# EAGLE design MACH32 (EAGLE 9.6.0)
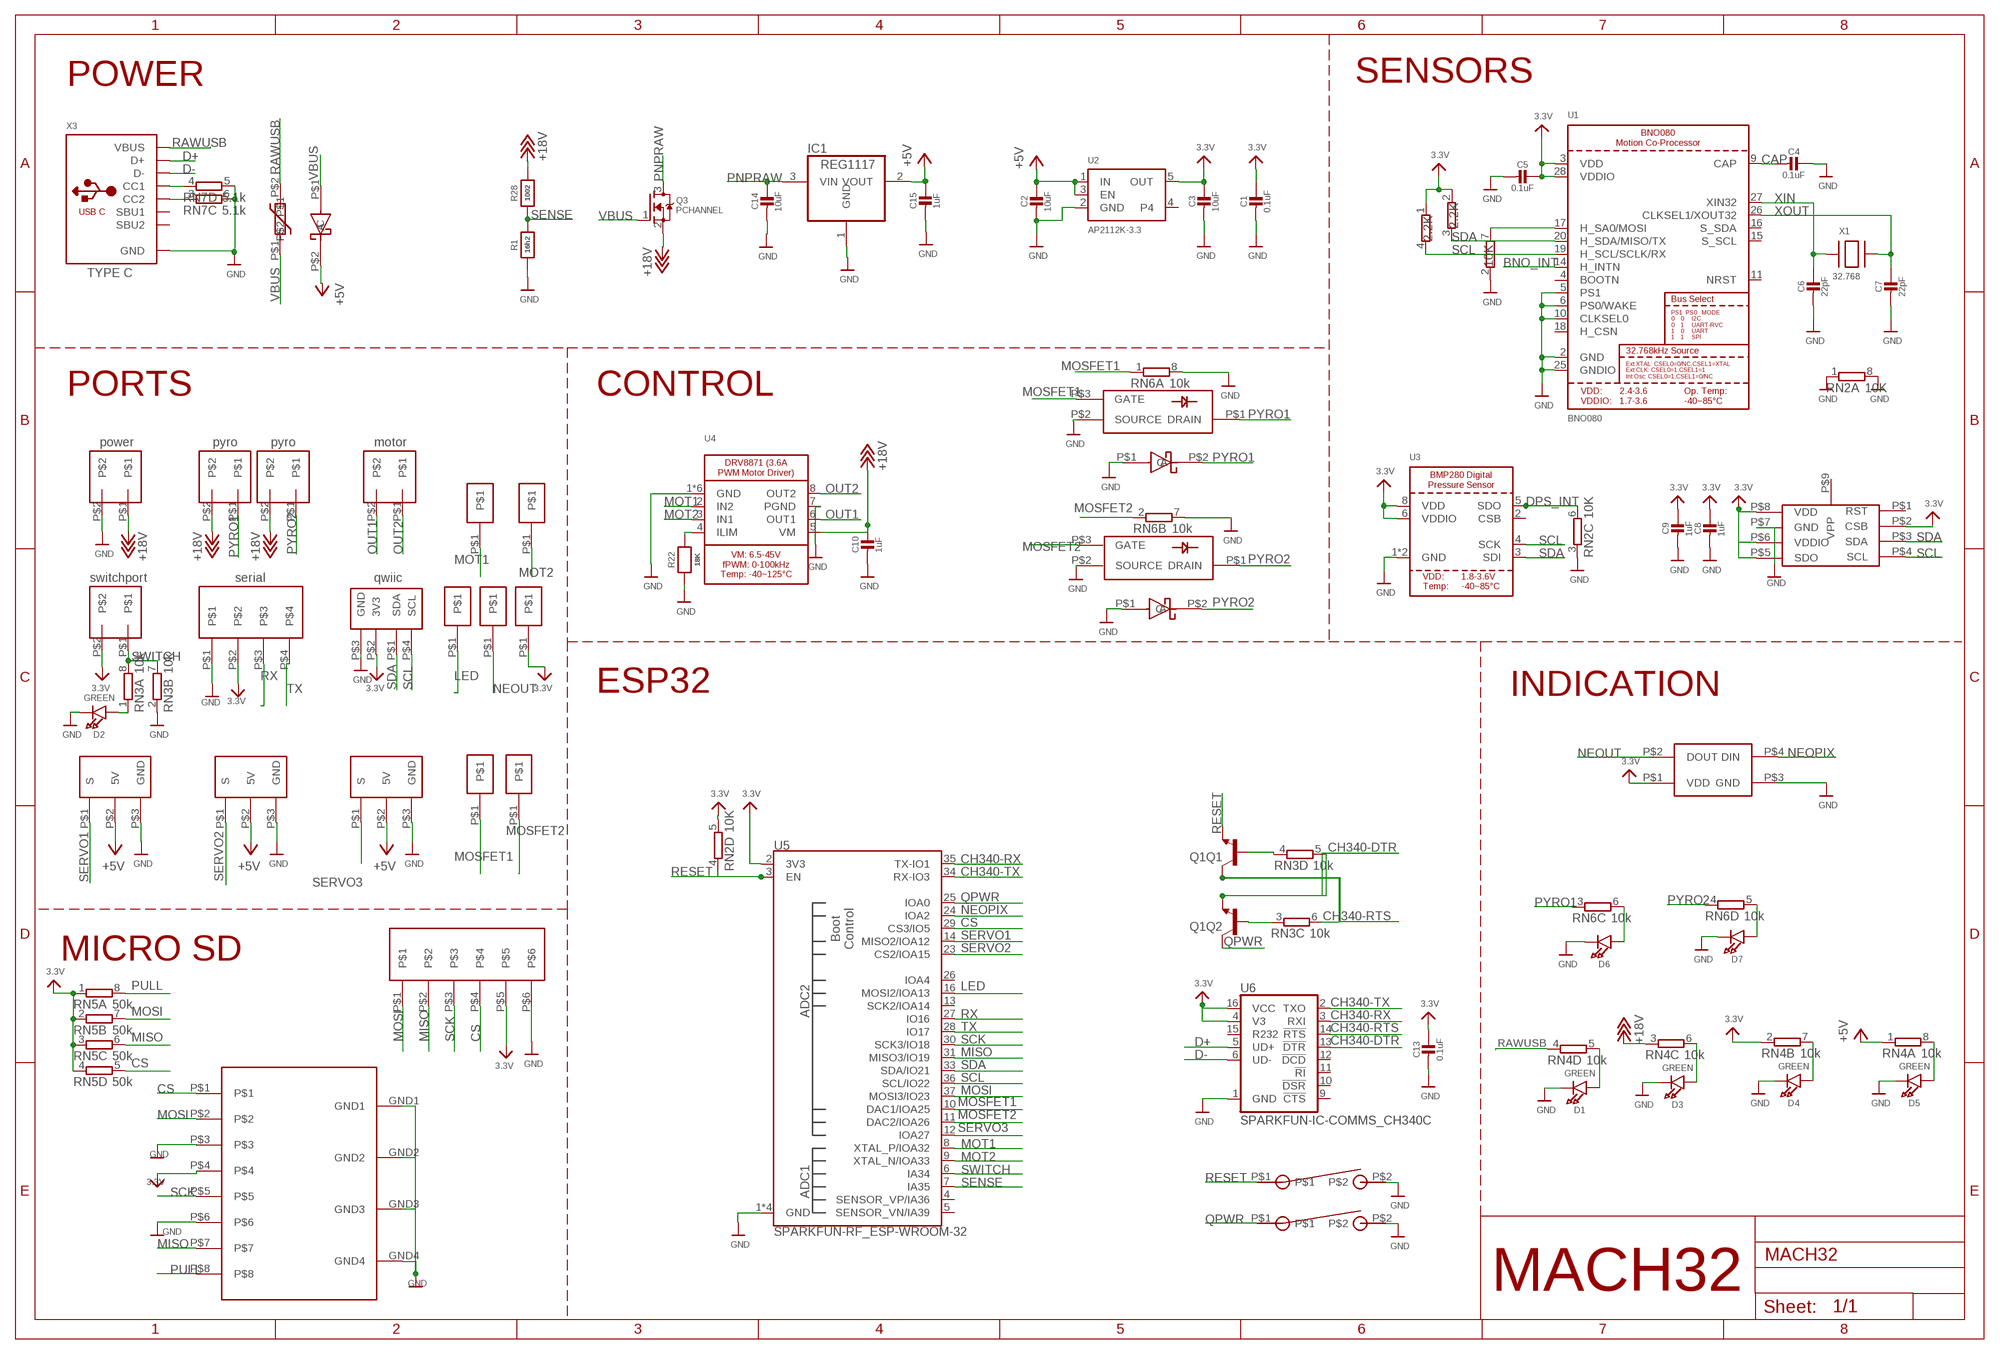
[diagram p0: schematic, sheet 1]

## Parts
C1  0.1uF  CAP_CERAMIC0603_NO  [0603-NO]
C2  10uF  CAP_CERAMIC0805-NOOUTLINE  [0805-NO]
C3  10uF  CAP_CERAMIC0805-NOOUTLINE  [0805-NO]
C4  0.1uF  CAP_CERAMIC0603_NO  [0603-NO]
C5  0.1uF  CAP_CERAMIC0603_NO  [0603-NO]
C6  22pF  CAP_CERAMIC0603_NO  [0603-NO]
C7  22pF  CAP_CERAMIC0603_NO  [0603-NO]
C8  1uF  CAP_CERAMIC0603_NO  [0603-NO]
C9  1uF  CAP_CERAMIC0603_NO  [0603-NO]
C10  1uF  CAP_CERAMIC0603_NO  [0603-NO]
C13  0.1uF  CAP_CERAMIC0603_NO  [0603-NO]
C14  10uF  CAP_CERAMIC0805-NOOUTLINE  [0805-NO]
C15  1uF  CAP_CERAMIC0603_NO  [0603-NO]
D1  GREEN  LED0603_NOOUTLINE  [CHIPLED_0603_NOOUTLINE]
D2  GREEN  LED0603_NOOUTLINE  [CHIPLED_0603_NOOUTLINE]
D3  GREEN  LED0603_NOOUTLINE  [CHIPLED_0603_NOOUTLINE]
D4  GREEN  LED0603_NOOUTLINE  [CHIPLED_0603_NOOUTLINE]
D5  GREEN  LED0603_NOOUTLINE  [CHIPLED_0603_NOOUTLINE]
D6  GREEN  LED0603_NOOUTLINE  [CHIPLED_0603_NOOUTLINE]
D7  GREEN  LED0603_NOOUTLINE  [CHIPLED_0603_NOOUTLINE]
GENERALDIODE  PG-TSDSON-8-32  [BSZ036NE2LSATMA1]
GENERALDIODE2  PG-TSDSON-8-32  [BSZ036NE2LSATMA1]
IC1  REG1117  [SOT223]
Q1  SPARKFUN-DISCRETESEMI_TRANS_NPN_DUAL-MBT3904DW1T1  [SPARKFUN-DISCRETESEMI_SC70-6]
Q3  PCHANNEL  MOSFET-NREFLOW  [SOT23]
R1  16h2  MICROBUILDER_RESISTOR_1206MP  [MICROBUILDER__1206MP]
R22  18K  MICROBUILDER_RESISTOR_0603MP  [MICROBUILDER__0603MP]
R28  1002  MICROBUILDER_RESISTOR_1206MP  [MICROBUILDER__1206MP]
RN1  2.2K  2R-NEXB34V  [EXB34V]
RN2  10K  4R-NEXB38V  [EXB38V]
RN3  10k  4R-NEXB38V  [EXB38V]
RN4  10k  4R-NEXB38V  [EXB38V]
RN5  50k  4R-NEXB38V  [EXB38V]
RN6  10k  4R-NEXB38V  [EXB38V]
RN7  5.1k  4R-NEXB38V  [EXB38V]
U1  BNO080  [BNO080]
U2  AP2112K-3.3  VREG_SOT23-5  [SOT23-5]
U3  BMP280_COMBO  [BMX280_COMBO]
U4  MICROBUILDER_DRV8871  [MICROBUILDER_HSOP8]
U5  SPARKFUN-RF_ESP-WROOM-32  [SPARKFUN-RF_ESP-WROOM-32]
U6  SPARKFUN-IC-COMMS_CH340C  [SPARKFUN-IC-COMMS_SO016]
U$17  2SMPB-02E  [2021]
U$25  OSTTEXX0104  [OSTTEXX0104]
U$27  OSTTEXX0104  [OSTTEXX0104]
U$28  OSTTEXX0104  [OSTTEXX0104]
U$30  OSTTEXX0104  [OSTTEXX0104]
U$31  DF3-4  [DF3-4]
U$32  QWIIC  [QWIIC_V]
U$34  OSTTEXX0104  [OSTTEXX0104]
U$47  PTC  [1210PTC]
U$48  SERVO  [SERVO]
U$49  SERVO  [SERVO]
U$50  SERVO  [SERVO]
U$51  SK681-2020  [SK6812-2020]
U$52  SS24FL  [XC6220]
U$53  SS24FL  [XC6220]
U$57  MALIPAD  [MALIPAD]
U$58  MALIPAD  [MALIPAD]
U$59  MALIPAD  [MALIPAD]
U$67  DF3-6  [DF3-6]
U$70  ST1W008S4AR1500  [ST1W008S4AR1500]
U$73  OMRONSWITCH  [BUTTONOMRON]
U$74  OMRONSWITCH  [BUTTONOMRON]
U$91  SS24FL  [XC6220]
U$100  MALIPAD  [MALIPAD]
U$104  MALIPAD  [MALIPAD]
U$105  MALIPAD  [MALIPAD]
U$106  MALIPAD  [MALIPAD]
X1  32.768  XTAL-3.2X1.5  [XTAL3215]
X3  MICROBUILDER_USB_C  [MICROBUILDER_USB_C_CUSB31-CFM2AX-01-X]

## Nets
3.3V [lowpower]: C1.1 C3.1 C5.1 C8.1 C9.1 C13.1 RN1.1 RN1.2 RN2.5 RN4.2 RN5.1 RN5.2 RN5.3 RN5.4 U1.3(VDD) U1.28(VDDIO) U2.5(OUT) U3.6(VDDIO) U3.8(VDD) U5.2(3V3) U6.4(V3) U6.16(VCC) U$17.P$2(CSB) U$17.P$5(SDO) U$17.P$6(VDDIO) U$17.P$8(VDD) U$31.P$2 U$32.P$2(3V3) U$34.P$2 U$51.P$1(VDD) U$57.P$1 U$67.P$5 U$70.P$4
+5V [lowpower]: C2.1 C15.1 IC1.2(VOUT) RN4.1 U2.1(IN) U2.3(EN) U$48.P$2(5V) U$49.P$2(5V) U$50.P$2(5V) U$91.P$2(C)
+18V: C10.1 Q3.2(S) R28.2 RN4.3 U4.5(VM) U$25.P$1 U$27.P$2 U$30.P$2
BNO_INT: U1.14(H_INTN)
CAP: C4.2 U1.9(CAP)
CH340-DTR: Q1.1(Q2:E) RN3.5 U6.13(!DTR)
CH340-RTS: Q1.3(Q1:C) RN3.6 U6.14(!RTS)
CH340-RX: U5.35(TX-IO1) U6.3(RXI)
CH340-TX: U5.34(RX-IO3) U6.2(TXO)
CS: RN5.5 U5.29(CS3/IO5) U$67.P$4 U$70.P$1
D+: U6.5(UD+) X3.A6(D+) X3.B6(D+)
D-: U6.6(UD-) X3.A7(D-) X3.B7(D-)
DPS_INT: RN2.6 U3.5(SDO)
GND [lowpower]: C1.2 C2.2 C3.2 C4.1 C5.2 C6.2 C7.2 C8.2 C9.2 C10.2 C13.2 C14.2 C15.2 D1.C D2.C D3.C D4.C D5.C D6.C D7.C GENERALDIODE2.P$2(SOURCE) GENERALDIODE.P$2(SOURCE) IC1.1(GND) R1.1 R22.1 RN2.1 RN2.2 RN2.3 RN2.8 RN3.2 RN6.7 RN6.8 RN7.5 RN7.6 U1.2(GND) U1.5(PS1) U1.6(PS0/WAKE) U1.10(CLKSEL0) U1.25(GNDIO) U2.2(GND) U3.1(GND) U3.7(GND) U4.1(GND) U4.7(PGND) U4.GND U4.P$1(GND) U4.P$2(GND) U4.P$3(GND) U4.P$4(GND) U5.1(GND) U5.15(GND) U5.38(GND) U5.GND U6.1(GND) U$17.P$7(GND) U$25.P$2 U$31.P$1 U$32.P$3(GND) U$48.P$3(GND) U$49.P$3(GND) U$50.P$3(GND) U$51.P$3(GND) U$52.P$1(A) U$53.P$1(A) U$67.P$6 U$70.GND1 U$70.GND2 U$70.GND3 U$70.GND4 U$70.P$3 U$70.P$6 U$73.P$2 U$74.P$2 X3.A1B12(GND) X3.B1A12(GND)
LED: U5.16(MOSI2/IOA13) U$59.P$1
MISO: RN5.6 U5.31(MISO3/IO19) U$67.P$2 U$70.P$7
MOSFET1: GENERALDIODE.P$3(GATE) RN6.1 U5.10(DAC1/IOA25) U$100.P$1
MOSFET2: GENERALDIODE2.P$3(GATE) RN6.2 U5.11(DAC2/IOA26) U$104.P$1
MOSI: RN5.7 U5.37(MOSI3/IO23) U$67.P$1 U$70.P$2
MOT1: U4.2(IN2) U5.8(XTAL_P/IOA32) U$105.P$1
MOT2: U4.3(IN1) U5.9(XTAL_N/IOA33) U$106.P$1
N$1: RN2.7 U1.17(H_SA0/MOSI)
N$3: D2.A RN3.1
N$6: D1.A RN4.5
N$9: R22.2 U4.4(ILIM)
N$10: D3.A RN4.6
N$11: D4.A RN4.7
N$12: D5.A RN4.8
N$14: Q1.5(Q1:B) RN3.4
N$15: Q1.2(Q2:B) RN3.3
N$20: RN7.4 X3.A5(CC1)
N$22: D6.A RN6.6
N$23: D7.A RN6.5
N$39: RN7.3 X3.B5(CC2)
NEOPIX: U5.24(IOA2) U$51.P$4(DIN)
NEOUT: U$51.P$2(DOUT) U$58.P$1
OUT1: U4.6(OUT1) U$28.P$2
OUT2: U4.8(OUT2) U$28.P$1
PNPRAW: C14.1 IC1.3(VIN) Q3.3(D)
PULL: RN5.8 U$70.P$8
PYRO1: GENERALDIODE.P$1(DRAIN) RN6.3 U$27.P$1 U$52.P$2(C)
PYRO2: GENERALDIODE2.P$1(DRAIN) RN6.4 U$30.P$1 U$53.P$2(C)
QPWR: Q1.6(Q2:C) U5.25(IOA0) U$73.P$1
RAWUSB: RN4.4 U$47.P$2 X3.A4B9(VBUS) X3.B4A9(VBUS)
RESET: Q1.4(Q1:E) RN2.4 U5.3(EN) U$74.P$1
RX: U5.27(IO16) U$31.P$3
SCK: U5.30(SCK3/IO18) U$67.P$3 U$70.P$5
SCL: RN1.4 U1.19(H_SCL/SCLK/RX) U3.4(SCK) U5.36(SCL/IO22) U$17.P$4(SCL) U$32.P$4(SCL)
SDA: RN1.3 U1.20(H_SDA/MISO/TX) U3.3(SDI) U5.33(SDA/IO21) U$17.P$3(SDA) U$32.P$1(SDA)
SENSE: R1.2 R28.1 U5.7(IA35)
SERVO1: U5.14(MISO2/IOA12) U$48.P$1(S)
SERVO2: U5.23(CS2/IOA15) U$49.P$1(S)
SERVO3: U5.12(IOA27) U$50.P$1(S)
SWITCH: RN3.7 RN3.8 U5.6(IA34) U$34.P$1
TX: U5.28(IO17) U$31.P$4
VBUS: Q3.1(G) U$47.P$1 U$91.P$1(A)
XIN: C6.1 U1.27(XIN32) X1.P$1
XOUT: C7.1 U1.26(CLKSEL1/XOUT32) X1.P$2
Unconnected: RN7.1 RN7.2 RN7.7 RN7.8 U1.4(BOOTN) U1.11(NRST) U1.15(S_SCL) U1.16(S_SDA) U1.18(H_CSN) U2.4 U3.2(CSB) U5.4(SENSOR_VP/IA36) U5.5(SENSOR_VN/IA39) U5.13(SCK2/IOA14) U5.26(IOA4) U6.9(!CTS) U6.10(!DSR) U6.11(!RI) U6.12(!DCD) U6.15(R232) U$17.P$1(RST) U$17.P$9(VPP) X3.A8(SBU1) X3.B8(SBU2)

## Notes on the sheet
- POWER | SENSORS
- TYPE C
- PORTS | CONTROL
- power | pyro | pyro | motor
- switchport | serial | qwiic
- ESP32 | INDICATION
- MICRO SD
- MACH32

## Library data of the parts
C1-C10 C13-C15 = microbuilder:CAP_CERAMIC: Ceramic Capacitors For new designs, use the packages preceded by an '_' character since they are more reliable: The following footprints should be used on most boards: _0402 - Standard footprint for regular board layouts _0603 - Standard footprint for regular board layouts _0805 - Standard footprint for regular board layouts _1206 - Standard footprint for regular board layouts For extremely tight-pitch boards where space is at a premium, the following 'micro-pitch' footprints can be used (smaller pads, no silkscreen outline, etc.): _0402MP - Micro-pitch footprint for very dense/compact boards _0603MP - Micro-pitch footprint for very dense/compact boards _0805MP - Micro-pitch footprint for very dense/compact boards _1206MP - Micro-pitch footprint for very dense/compact boards
D1-D6 = microbuilder:LED: LED 0603 - 0603 Surface Mount Package 2mA: Green LED - Low Power (3.9mcd, 2ma, 1.7Vf) - Digikey: 475-2709-2-ND Orange LED - Low Power (9.8mcd, 2ma, 1.8Vf) - Digikey: 475-1194-2-ND Red LED - Low Power (5mcd, 2ma, 1.8Vf) - Digikey: 475-1195-2-ND Yellow LED - Low Power (7mcd, 2ma, 1.8Vf) - Digikey: 475-1196-2-ND 5mA: Blue LED - Low Power (17mcd, 5ma, 2.9Vf) - Digikey: LNJ937W8CRACT-ND 0805 - 0805 Surface Mount Package 2mA: Red LED (8.8mcd, 2mA, 1.8Vf, Clear) - Low Power [Digikey: 475-2510-1-ND] Green LED (5mcd, 2mA, 1.8Vf, Clear) - Low Power [Digikey: 475-2730-1-ND] Yellow LED (11.3mcd, 2mA, 1.8Vf, Clear) - Low Power [Digikey: 475-2555-1-ND] 20mA: Red LED (104mcd, 20mA, Diffused) - LS R976 [Digikey: 475-1278-6-ND] Red LED (12mcd, 20mA, 2.0Vf, Clear) - APT2012EC [Digikey: 754-1128-1-ND] Green LED (15mcd, 20mA, 2.2Vf, Clear) - APT2012GC [Digikey: 754-1131-1-ND] Orange LED (160mcd, 20mA, 2.1Vf, Clear) - APT2012SECK [Digikey: 754-1130-1-ND] 1206 - 1206 Surface Mount Package Green LED (26mcd, 20mA, Diffused) - LG N971 [Digikey: 475-1407-6-ND] Red LED (15mcd, 20mA, Diffused) - LH N974 [Digikey: 475-1416-6-ND] Cree - Cree High-Power Surface Mount LEDs XPEBWT-L1-0000-00D50 - White 111lm 350mA 2.9Vf 6200K 110° XTEAWT-00-0000-00000LEE3 - White 114lm 350mA 2.85Vf 5000K 115° Everlight - Everlight 45-21 Series Surface Mount LEDs 45-21/QK2C-B2832AC2CB2/2T - Warm White 2000mcd 20mA 3.25Vf 3050K 120° 45-21/LK2C-B38452C4CB2/2T - Nuetral White 2000mcd 20mA 3.25Vf 4150K 120° 45-21/LK2C-B50634C6CB2/2T - Cold White 2200mcd 20mA 3.25Vf 5650K 120° PLCC2 Reverse Mount LS T77K-J1L2-1-0-2-R18-Z - Red 11.25mcd 2mA 1.8Vf 630nm 120° LO T77K-L1M2-24-Z - Orange 19.6mcd 2mA 1.8Vf 606nm 120° LY T77K-K2M1-26-Z - Yellow 15.7mcd 2mA 1.8Vf 587nm 120°
D7 = microbuilder:LED: LED 0603 - 0603 Surface Mount Package 2mA: Green LED - Low Power (3.9mcd, 2ma, 1.7Vf) - Digikey: 475-2709-2-ND Orange LED - Low Power (9.8mcd, 2ma, 1.8Vf) - Digikey: 475-1194-2-ND Red LED - Low Power (5mcd, 2ma, 1.8Vf) - Digikey: 475-1195-2-ND Yellow LED - Low Power (7mcd, 2ma, 1.8Vf) - Digikey: 475-1196-2-ND 5mA: Blue LED - Low Power (17mcd, 5ma, 2.9Vf) - Digikey: LNJ937W8CRACT-ND 0805 - 0805 Surface Mount Package 2mA: Red LED (8.8mcd, 2mA, 1.8Vf, Clear) - Low Power [Digikey: 475-2510-1-ND] Green LED (5mcd, 2mA, 1.8Vf, Clear) - Low Power [Digikey: 475-2730-1-ND] Yellow LED (11.3mcd, 2mA, 1.8Vf, Clear) - Low Power [Digikey: 475-2555-1-ND] 20mA: Red LED (104mcd, 20mA, Diffused) - LS R976 [Digikey: 475-1278-6-ND] Red LED (12mcd, 20mA, 2.0Vf, Clear) - APT2012EC [Digikey: 754-1128-1-ND] Green LED (15mcd, 20mA, 2.2Vf, Clear) - APT2012GC [Digikey: 754-1131-1-ND] Orange LED (160mcd, 20mA, 2.1Vf, Clear) - APT2012SECK [Digikey: 754-1130-1-ND] 1206 - 1206 Surface Mount Package Green LED (26mcd, 20mA, Diffused) - LG N971 [Digikey: 475-1407-6-ND] Red LED (15mcd, 20mA, Diffused) - LH N974 [Digikey: 475-1416-6-ND] Cree - Cree High-Power Surface Mount LEDs XPEBWT-L1-0000-00D50 - White 111lm 350mA 2.9Vf 6200K 110° XTEAWT-00-0000-00000LEE3 - White 114lm 350mA 2.85Vf 5000K 115° Everlight - Everlight 45-21 Series Surface Mount LEDs 45-21/QK2C-B2832AC2CB2/2T - Warm White 2000mcd 20mA 3.25Vf 3050K 120° 45-21/LK2C-B38452C4CB2/2T - Nuetral White 2000mcd 20mA 3.25Vf 4150K 120° 45-21/LK2C-B50634C6CB2/2T - Cold White 2200mcd 20mA 3.25Vf 5650K 120° PLCC2 Reverse Mount LS T77K-J1L2-1-0-2-R18-Z - Red 11.25mcd 2mA 1.8Vf 630nm 120° LO T77K-L1M2-24-Z - Orange 19.6mcd 2mA 1.8Vf 606nm 120° LY T77K-K2M1-26-Z - Yellow 15.7mcd 2mA 1.8Vf 587nm 120°; SPICEPREFIX: D
GENERALDIODE GENERALDIODE2 = DF3-4:PG-TSDSON-8-32
IC1 = burr-brown:REG1117: 800mA and 1A Low Dropout (LDO) Positive Regulator 1.8V, 2.5V, 2.85V, 3.3V, 5V, and Adj; MPN: REG1117; OC_FARNELL: 1097566; OC_NEWARK: 14P6981
Q1 = SparkFun ESP32 Thing Plus C:SPARKFUN-DISCRETESEMI_TRANS_NPN_DUAL: Dual NPN Transistors in Single Package The MBT3904W1 puts two general purpose 3904 NPN transistors in a single package. Datasheet <http://www.onsemi.com/pub_link/Collateral/MBT3904DW1T1-D.PDF> SparkFun Products: SparkFun ESP32 Thing <https://www.sparkfun.com/products/13907>; PROD_ID: TRANS-13337
Q3 = adafruit:MOSFET-N: N-Channel Mosfet 2N7002E - 60V 260mA SOT23 [Digikey: 2N7002ET1GOSTR-ND] - REEL BSH103 - 30V 850mA SOT23 [Digikey: 568-5013-1-ND]
R1 R22 R28 = Adafruit Feather M4 Express:MICROBUILDER_RESISTOR: Resistors For new designs, use the packages preceded by an '_' character since they are more reliable: The following footprints should be used on most boards: _0402 - Standard footprint for regular board layouts _0603 - Standard footprint for regular board layouts _0805 - Standard footprint for regular board layouts _1206 - Standard footprint for regular board layouts For extremely tight-pitch boards where space is at a premium, the following 'micro-pitch' footprints can be used (smaller pads, no silkscreen outline, etc.): _0402MP - Micro-pitch footprint for very dense/compact boards _0603MP - Micro-pitch footprint for very dense/compact boards _0805MP - Micro-pitch footprint for very dense/compact boards _1206MP - Micro-pitch footprint for very dense/compact boards
RN1 = resistor-dil:2R-N: Array Chip Resistor Source: Panasonic; OC_FARNELL: unknown; OC_NEWARK: unknown
RN2 RN4 RN6 RN7 = resistor-dil:4R-N: Array Chip Resistor Source: RS Component / Phycomp; OC_FARNELL: unknown; OC_NEWARK: unknown
RN3 RN5 = resistor-dil:4R-N: Array Chip Resistor Source: RS Component / Phycomp; OC_FARNELL: unknown; OC_NEWARK: unknown; SPICEPREFIX: R
U1 = microbuilder:BNO080: BNO080 - Motion Co-Processor
U2 = microbuilder:VREG_SOT23-5: SOT23-5 Fixed Voltage Regulators Part Current Out V Out V In V Dropout θJA (°C/W) TJ (°C) Digikey Part No. ADP121 150mA 3.3V 3.4-5.5V 0.09V @ 150mA -- -- ADP121-AUJZ33R7CT-ND ADP121 150mA 3.0V 3.1-5.5V 0.09V @ 150mA -- -- ADP121-AUJZ30R7CT-ND ADP122 300mA 3.3V 3.4-5.5V 0.085V @ 300mA -- -- ADP122AUJZ-3.3-R7CT-ND ADP1712 300mA 3.3V 3.5-5.5V 0.17V @ 300mA -- -- ADP1712AUJZ-3.3-R7TR-ND AP7311 (Low Cost) 150mA 3.3V 3.5-6V 0.15V @ 150mA -- -- AP7311-33WG-7DICT-ND LD39015M18R 150mA 1.8V 1.9V-5.5V 0.08V @ 100mA -- -- 497-6977-1-ND LP2985A-33DBVR 150mA 3.3V 3.3-16V 0.28V @ 150mA 206 150 296-18479-1-ND MCP1824T-3302E/OT 300mA 3.3V 3.5V-6V 0.2V @ 300mA -- -- MCP1824T-3302E/OTCT-ND MIC5205-2.5YM5 TR 150mA 2.5V 2.7-16V 0.165V @ 150mA -- -- 576-1257-2-ND MIC5205-3.0YM5 TR 150mA 3.0V 3.2V-16V 0.165V @ 150mA -- -- 576-1258-2-ND MIC5205-3.3YM5 TR 150mA 3.3V 3.5V-16V 0.165V @ 150mA -- -- 576-1259-2-ND TPS780330220 150mA 3.3V+2.2V 3.6-5.5V 250mV Max -- -- 296-23332-1-ND TDA3663/N1,135 100mA 3.3V 3.5-45V 0.18V @ 50mA -- -- 568-5343-1-ND Max operating temp can be calculated using θJA, TJ (max junction temperature), and power in watts. Set the "Maximum Ambient Temperature" until it reaches TJ ("Max Junction Temperature"), which is the absolute limit for safe use of the regulator: Heat Sink Temperature Calculator <http://www.daycounter.com/Calculators/Heat-Sink-Temperature-Calculator.phtml> For example, With 12V source into a 3.3V LP2985 and a 30mA load, we are dissipating (12V-3.3V) * 0.03A = 0.261W. With a θJA of 206 °C/W, a TJ of 150°C, and 261mW we can safely use the chip without a heat sink up to 75°C (=147.1°C Junction Temperature).
U3 = adafruit_sensor:BMP280: BMP280 - Digital Pressure Sensor Operating Pressure Range: 300-1100 hPa Pressure Resolution: 0.16Pa RMS Noise: 1.3Pa Temperature Resolution: 0.01 C
U4 = Adafruit DRV8871:MICROBUILDER_DRV8871: DRV8871 - 3.6A PWM Motor Driver
U5 = SparkFun ESP32 Thing Plus C:SPARKFUN-RF_ESP-WROOM-32; PROD_ID: IC-13849
U6 = SparkFun ESP32 Thing Plus C:SPARKFUN-IC-COMMS_CH340C; PROD_ID: IC-14038
U$17 = DF3-4:2SMPB-02E
U$25 = DF3-4:OSTTEXX0104; SPICEPREFIX: B
U$27 U$28 U$30 U$34 = DF3-4:OSTTEXX0104
U$31 = DF3-4:DF3-4
U$32 = DF3-4:QWIIC
U$47 = DF3-4:PTC
U$48-U$50 = DF3-4:SERVO
U$51 = DF3-4:SK681-2020
U$52 U$53 U$91 = DF3-4:SS24FL
U$57-U$59 U$100 U$104-U$106 = DF3-4:MALIPAD
U$67 = DF3-4:DF3-6
U$70 = DF3-4:ST1W008S4AR1500
U$73 U$74 = DF3-4:OMRONSWITCH
X1 = adafruit2:XTAL: Low cost SMT crystals, no capacitors included http://www.ladyada.net/library/eagle
X3 = Adafruit Feather STM32F405 Express:MICROBUILDER_USB_C: USB Type-C USB 2.0 Connector

## Net classes
1 highpower: width 0.305 mm, drill 0.483 mm
2 lowpower: width 0.254 mm, drill 0.381 mm

## Board
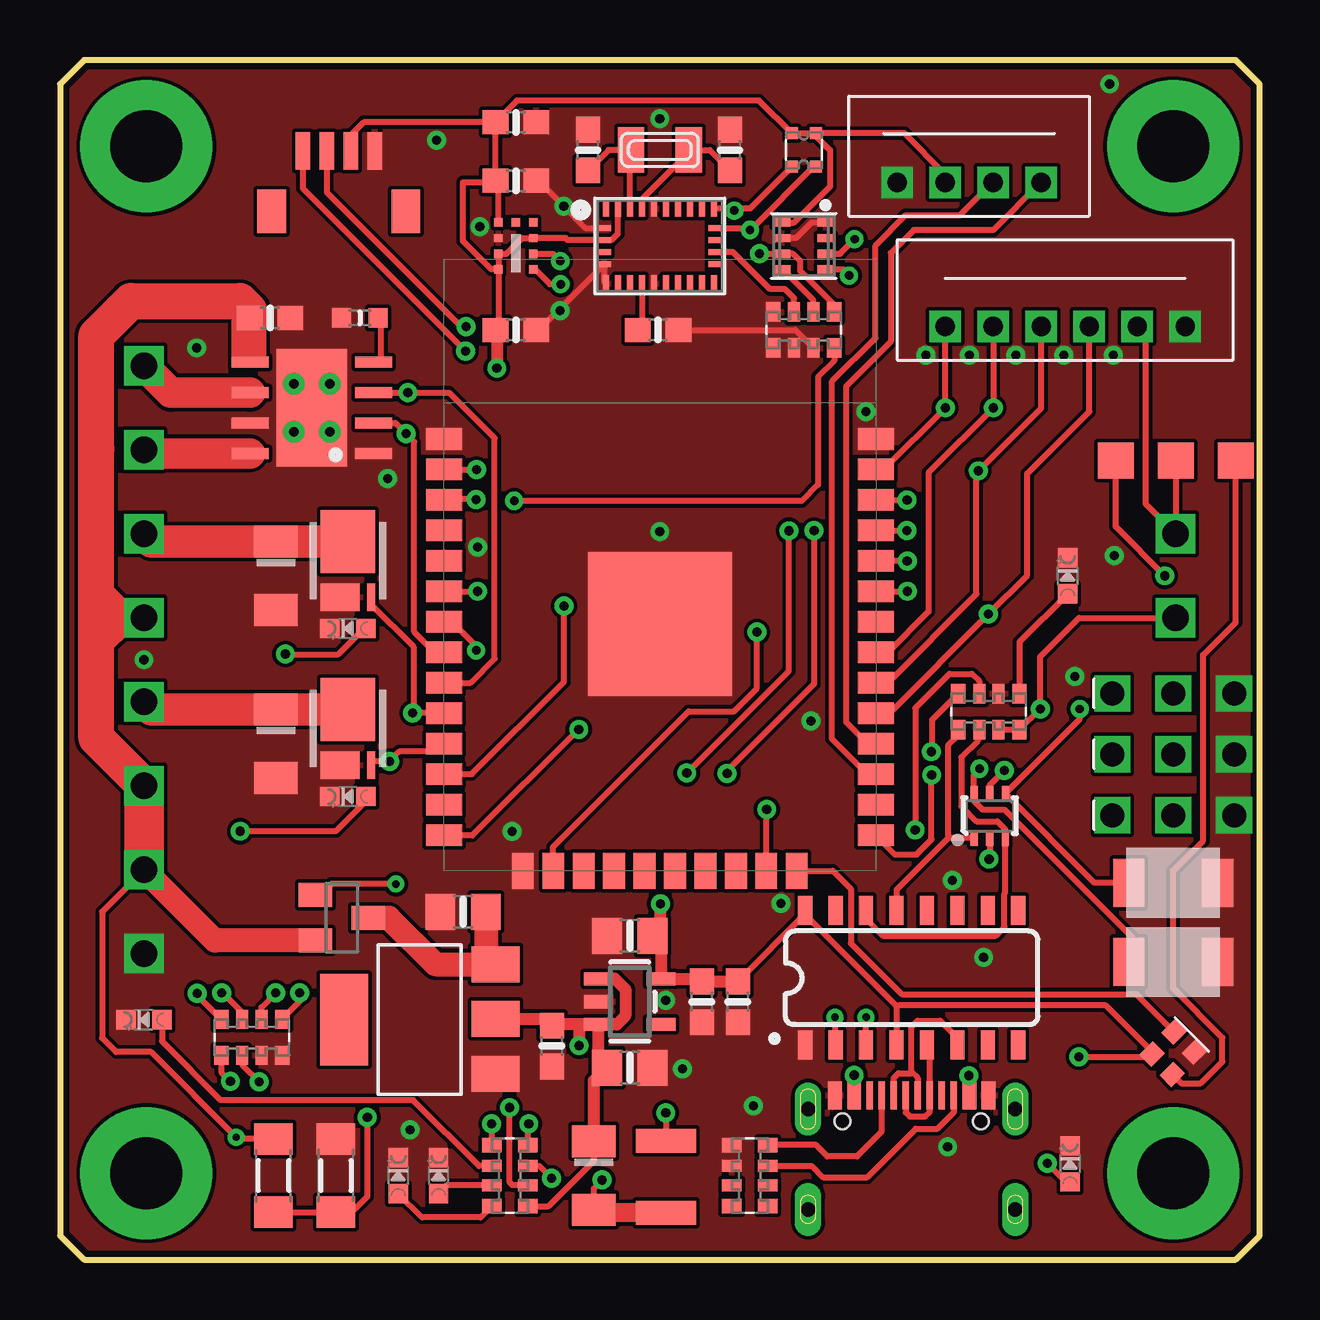
[diagram p1: board, top side]
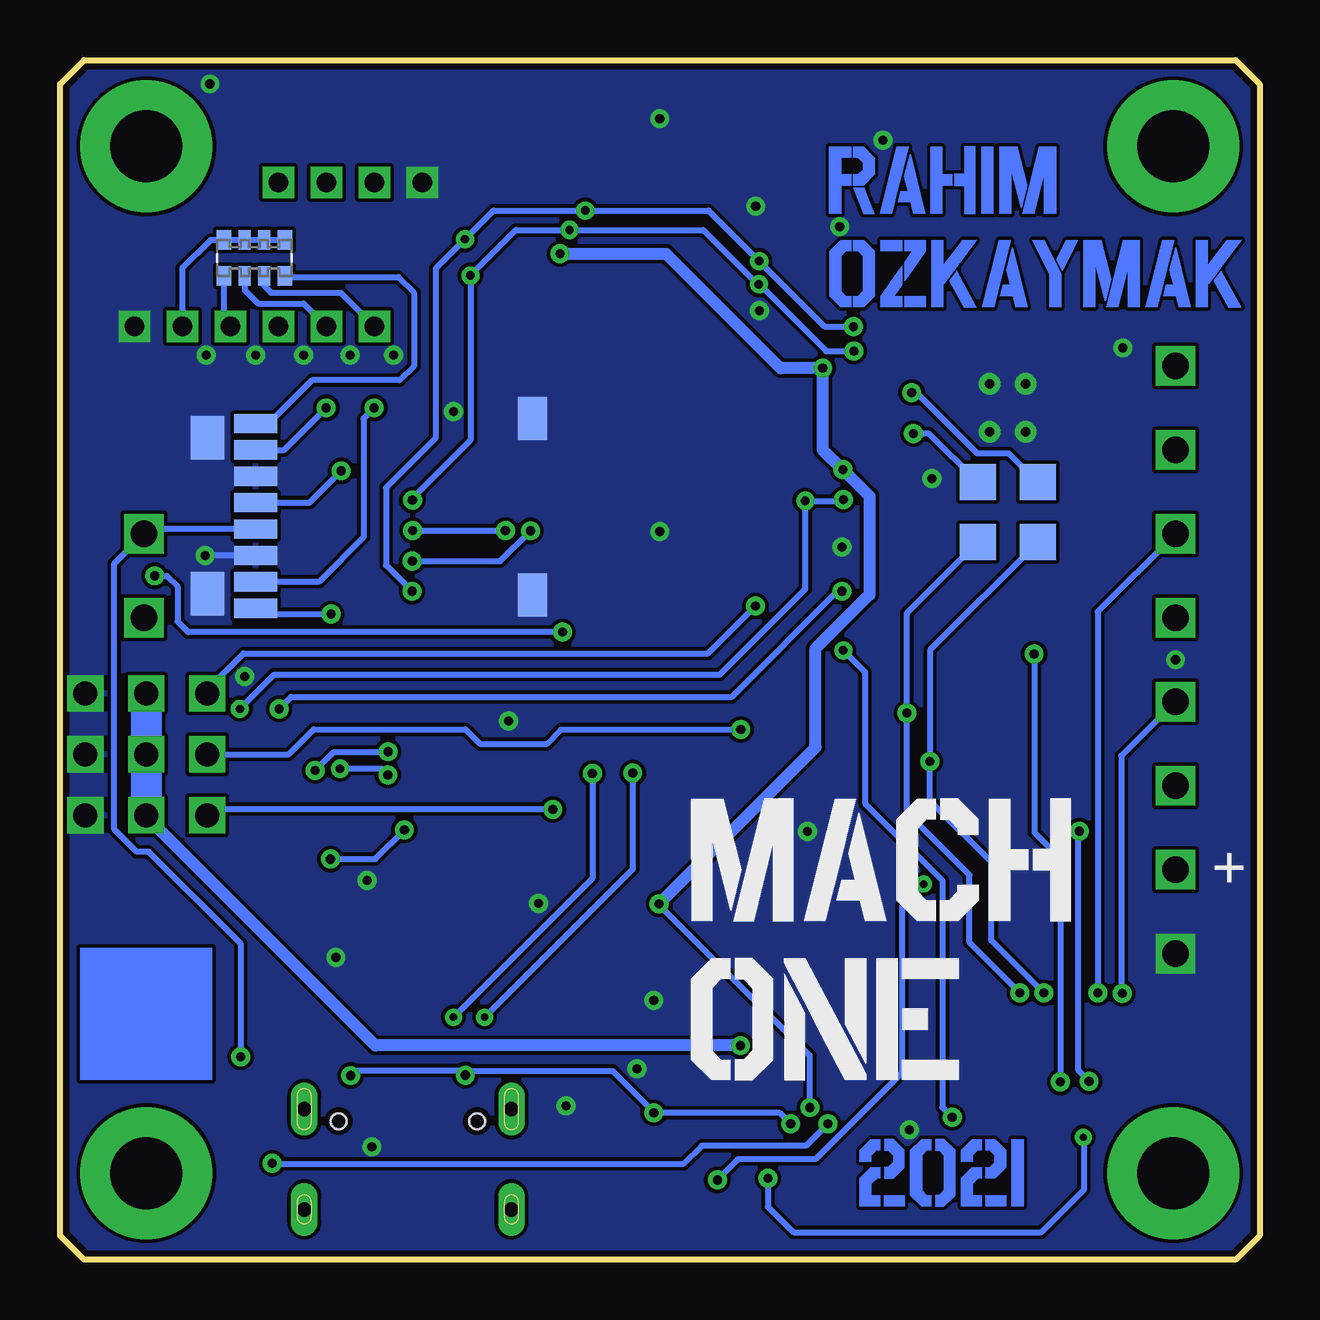
[diagram p2: board, bottom side, seen from below]

Size 50 x 50 mm. Coordinates in mm from the lower left corner, seen from the top.
Outline: 0,49 0,1 1,0 49,0 50,1 50,49 49,50 1,50 0,49
Copper layers (1*16): Top 0.035mm / dielectric 1.5mm / Bottom 0.035mm
Design rules "default *": minimum track width 6mil, minimum drill 0.3mm, track to track 6mil, track to pad 6mil, pad to pad 6mil, via to via 6mil, smd to smd 6mil, copper to edge 10mil, drill to drill 6mil, minimum pad ring 10mil, minimum via ring 8mil, stop-mask expansion 4mil, vias tented up to drill 15mil, thermal gap 0mil

### Footprints (pad centres in the part's own frame; a part is rotated, then mirrored left to right if it is on the bottom)
0603-NO = smd 1.075 x 1: 1 -0.85,0; 2 0.85,0
0805-NO = smd 1.24 x 1.5: 1 -0.95,0; 2 0.95,0
CHIPLED_0603_NOOUTLINE = smd 0.8 x 0.8: A 0,-0.75; C 0,0.75
BSZ036NE2LSATMA1 = smd 2.29 x 2.61: P$1 0,0.795 | smd 1.64 x 1.15: P$2 -0.325,-1.525 | smd 0.34 x 1.15: P$3 0.975,-1.525
SOT223 = smd 1.499 x 2.007: 1 -2.261,-3.15; 2 0.025,-3.15; 3 2.311,-3.15 | smd 3.81 x 2.007: 4 0,3.15
SPARKFUN-DISCRETESEMI_SC70-6 = smd 0.3 x 0.66: 1 -0.65,-0.92; 2 0,-0.92; 3 0.65,-0.92; 4 0.65,0.92; 5 0,0.92; 6 -0.65,0.92
SOT23 = smd 1 x 1.4: 1 -0.95,-1.1; 2 0.95,-1.1; 3 0,1.1
MICROBUILDER__1206MP = smd 1.3 x 1.6: 1 -1.524,0; 2 1.524,0
MICROBUILDER__0603MP = smd 0.8 x 0.8: 1 -0.762,0; 2 0.762,0
EXB34V = smd 0.5 x 0.5: 1 -0.5,-0.7; 2 0.5,-0.7; 3 0.5,0.7; 4 -0.5,0.7
EXB38V = smd 0.6 x 0.8: 1 -1.275,-0.75; 4 1.275,-0.75; 5 1.275,0.75; 8 -1.275,0.75 | smd 0.5 x 0.8: 2 -0.4,-0.75; 3 0.4,-0.75; 6 0.4,0.75; 7 -0.4,0.75
BNO080 = smd 0.25 x 0.675: 1 -2.25,1.562; 6 -2.25,-1.562; 7 -1.75,-1.562; 8 -1.25,-1.562; 9 -0.75,-1.562; 10 -0.25,-1.562; 11 0.25,-1.562; 12 0.75,-1.562; 13 1.25,-1.562; 14 1.75,-1.562; 15 2.25,-1.562; 20 2.25,1.562; 21 1.75,1.562; 22 1.25,1.562; 23 0.75,1.562; 24 0.25,1.562; 25 -0.25,1.562; 26 -0.75,1.562; 27 -1.25,1.562; 28 -1.75,1.562 | smd 0.575 x 0.25: 2 -2.312,0.75; 3 -2.312,0.25; 4 -2.312,-0.25; 5 -2.312,-0.75; 16 2.312,-0.75; 17 2.312,-0.25; 18 2.312,0.25; 19 2.312,0.75
SOT23-5 = smd 0.55 x 1.2: 1 -0.95,-1.3; 2 0,-1.3; 3 0.95,-1.3; 4 0.95,1.3; 5 -0.95,1.3
BMX280_COMBO = smd 0.725 x 0.35: 1 0.925,0.975; 2 0.925,0.325; 3 0.925,-0.325; 4 0.925,-0.975; 5 -0.925,-0.975; 6 -0.925,-0.325; 7 -0.925,0.325; 8 -0.925,0.975
MICROBUILDER_HSOP8 = smd 0.45 x 1.55: 1 -1.905,-2.575; 2 -0.635,-2.575; 3 0.635,-2.575; 4 1.905,-2.575; 5 1.905,2.575; 6 0.635,2.575; 7 -0.635,2.575; 8 -1.905,2.575 | smd 4.9 x 2.95: GND 0,0 | drill 0.4: P$1 -1,0.75; P$2 -1,-0.75; P$3 1,-0.75; P$4 1,0.75
SPARKFUN-RF_ESP-WROOM-32 = smd 0.9 x 1.5: 1 7.7,9; 2 6.43,9; 3 5.16,9; 4 3.89,9; 5 2.62,9; 6 1.35,9; 7 0.08,9; 8 -1.19,9; 9 -2.46,9; 10 -3.73,9; 11 -5,9; 12 -6.27,9; 13 -7.54,9; 14 -8.81,9; 25 -8.81,-9; 26 -7.54,-9; 27 -6.27,-9; 28 -5,-9; 29 -3.73,-9; 30 -2.46,-9; 31 -1.19,-9; 32 0.08,-9; 33 1.35,-9; 34 2.62,-9; 35 3.89,-9; 36 5.16,-9; 37 6.43,-9; 38 7.7,-9 | smd 1.5 x 0.9: 15 -10.3,5.715; 16 -10.3,4.445; 17 -10.3,3.175; 18 -10.3,1.905; 19 -10.3,0.635; 20 -10.3,-0.635; 21 -10.3,-1.905; 22 -10.3,-3.175; 23 -10.3,-4.445; 24 -10.3,-5.715 | smd 6 x 6: GND 0,0
SPARKFUN-IC-COMMS_SO016 = smd 0.6 x 1.2: 1 -4.445,-2.8; 2 -3.175,-2.8; 3 -1.905,-2.8; 4 -0.635,-2.8; 5 0.635,-2.8; 6 1.905,-2.8; 7 3.175,-2.8; 8 4.445,-2.8; 9 4.445,2.8; 10 3.175,2.8; 11 1.905,2.8; 12 0.635,2.8; 13 -0.635,2.8; 14 -1.905,2.8; 15 -3.175,2.8; 16 -4.445,2.8
2021 = smd 0.35 x 0.35: P$1 0.725,0.975; P$2 0.725,0.325; P$3 0.725,-0.325; P$4 0.725,-0.975; P$5 -0.725,-0.975; P$6 -0.725,-0.325; P$7 -0.725,0.325; P$8 -0.725,0.975; P$9 0,0.975
OSTTEXX0104 = drill 1.1 square: P$1 -1.75,0; P$2 1.75,0
DF3-4 = drill 0.8 square: P$1 -3,0; P$2 -1,0; P$3 1,0; P$4 3,0
QWIIC_V = smd 0.6 x 1.55: P$1 -0.5,0; P$2 0.5,0; P$3 1.5,0; P$4 -1.5,0 | smd 1.2 x 1.8: P$5 -2.8,-2.525; P$6 2.8,-2.525
1210PTC = smd 1 x 2.5: P$1 -1.5,0; P$2 1.5,0
SERVO = drill 1 square: P$1 -2.54,0; P$2 0,0; P$3 2.54,0
SK6812-2020 = smd 0.8 x 0.7: P$1 0.65,-0.6; P$2 0.65,0.6; P$3 -0.65,0.6; P$4 -0.65,-0.6
XC6220 = smd 1.34 x 1.8: P$1 -1.43,0; P$2 1.43,0
MALIPAD = smd 1.5 x 1.5: P$1 0,0
DF3-6 = drill 0.8 square: P$1 -5,0; P$2 -3,0; P$3 -1,0; P$4 1,0; P$5 3,0; P$6 5,0
ST1W008S4AR1500 = smd 1.2 x 1.8: GND1 7.2,-3.3; GND2 7.2,4.05 | smd 1.4 x 1.8: GND3 -6.35,-3.25; GND4 -6.35,3.25 | smd 1.8 x 0.8: P$1 -4.35,-3.85; P$2 -4.35,-2.75; P$3 -4.35,-1.65; P$4 -4.35,-0.55; P$5 -4.35,0.55; P$6 -4.35,1.65; P$7 -4.35,2.75; P$8 -4.35,3.85
BUTTONOMRON = smd 1.3 x 2: P$1 -1.85,0; P$2 1.85,0
XTAL3215 = smd 1.1 x 1.9: P$1 1.2,0; P$2 -1.2,0
MICROBUILDER_USB_C_CUSB31-CFM2AX-01-X = smd 0.575 x 1.15: A1B12 -3.2,3.545; A4B9 -2.4,3.545; B1A12 3.2,3.545; B4A9 2.4,3.545 | smd 0.275 x 1.15: A5 -1.25,3.545; A6 -0.25,3.545; A7 0.25,3.545; A8 1.25,3.545; B5 1.75,3.545; B6 0.75,3.545; B7 -0.75,3.545; B8 -1.75,3.545 | drill 0.6 pad 1 long: M1 -4.32,2.97; M2 4.32,2.97; M3 -4.32,-1.21; M4 4.32,-1.21 | hole 0.65: 2.89,2.47; -2.89,2.47

### Placement (x,y rotation side)
C1  26.75,10.75 270 top
C2  23.75,8 0 top
C3  23.75,13.5 180 top
C4  24.93,38.75 180 top
C5  19,47.4 0 top
C6  22.01,46.25 90 top
C7  27.93,46.25 90 top
C8  19,38.75 0 top
C9  19,44.96 0 top
C10  8.75,39.25 0 top
C13  28.25,10.75 270 top
C14  16.8,14.5 180 top
C15  20.5,8.9 270 top
D1  42.1,3.99 0 top
D2  42,28.5 0 top
D3  3.5,10 90 top
D4  15.78,3.5 0 top
D5  14.1,3.5 0 top
D6  12,26.3 90 top
D7  12,19.3 90 top
GENERALDIODE  12,29.13 0 top
GENERALDIODE2  12,22.13 0 top
IC1  15,10 90 top
Q1  38.75,18.5 0 top
Q3  11.75,14.25 270 top
R1  [MICROBUILDER__1206MP]  11.5,3.5 270 top
R22  12.5,39.25 0 top
R28  [MICROBUILDER__1206MP]  8.9,3.5 90 top
RN1  31,46.25 180 top
RN2  31,38.75 0 top
RN3  38.72,22.84 180 top
RN4  18.75,3.5 90 top
RN5  41.9,41.75 180 bottom
RN6  8,9.26 180 top
RN7  28.75,3.5 90 top
U1  25,42.25 0 top
U2  23.75,10.75 270 top
U3  31,42.25 0 top
U4  10.5,35.5 90 top
U5  25,26.5 90 top
U6  35.5,11.75 0 top
U$17  19,42.25 0 top
U$25  3.5,14.5 270 top
U$27  3.5,28.5 270 top
U$28  3.5,35.5 90 top
U$30  3.5,21.5 270 top
U$31  37.9,44.9 0 top
U$32  11.62,46.21 0 top
U$34  46.5,28.5 90 top
U$47  25.25,3.45 90 top
U$48  46.4,21.06 0 top
U$49  46.4,18.52 0 top
U$50  46.4,23.6 0 top
U$51  46.4,8.6 225 top
U$52  9,28.5 90 top
U$53  9,21.5 90 top
U$57  46.5,33.3 0 top
U$58  49,33.3 0 top
U$59  44,33.3 0 top
U$67  41.9,38.9 0 top
U$70  37.5,31 0 bottom
U$73  46.4,12.4 0 top
U$74  46.4,15.7 0 top
U$91  22.25,3.5 90 top
U$94  [OSHW_5MM]  46.4,10 0 bottom
U$100  11.75,29.9 0 bottom
U$102  [2021TRUE]  16.7,2.15 0 bottom
U$104  9.25,29.9 0 bottom
U$105  11.75,32.4 0 bottom
U$106  9.25,32.4 0 bottom
U$107  [RAHIM]  18.35,43.25 0 bottom
U$108  [OZKAYMAK]  18.55,39.35 0 bottom
U$109  [A]  23.95,13.85 0 bottom
U$110  [ONE]  23.95,7.15 0 bottom
X1  25,46.25 180 top
X3  35.5,3.3 0 top

### Tracks (layer width: path | path; a pad name or v marks a point on that pad's centre or on a via)
3.3V  (via drill 0.38)
  Top 0.254: C13.1 31.05,14.4 U6.16 31.05,14.39 34.87,10.58 34.87,10.51 | U$17.P$5 18.27,38.88 C8.1 | U$17.P$5 U$17.P$6 18.61,41.92 19.25,42.58 U$17.P$2 21.07,42.58 21.15,42.5 U1.3 23,42.5 23.25,42.76 U1.28 | U$17.P$8 18.27,44.84 C9.1 18.15,45.05 | 18.15,45.05 C5.1 | RN2.5 32.27,39.78 30.86,41.2 30.86,41.62 30.55,41.92 U3.6 v29.16,41.92 | U3.8 30.6,43.23 32.09,44.72 32.09,46.24 31.39,46.95 RN1.1 | U5.2 v17.36,32.93 v17.36,32.92 | 34.87,10.51 34.94,10.59 43.6,10.59 45.34,8.84 | 34.87,10.51 U6.4 | RN4.2 18.86,3.1 18.74,3.21 v18.74,6.33 | RN1.1 RN1.2 29.14,48.31 19.05,48.31 C5.1 | RN1.1 35.2,46.95 36.9,45.25 U$31.P$2 | 45.34,8.84 45.49,8.69 45.24,8.45 v42.47,8.45 | U$51.P$1 45.34,8.74 45.34,8.84 | U$32.P$2 12.12,46.86 12.66,47.4 C5.1 | 18.15,45.05 18,44.9 16.8,44.9 16.8,42.45 17.98,41.27 U$17.P$5 | U$67.P$5 45.25,38.55 45.25,31.5 U$34.P$2 U$57.P$1
  Top 0.4: 26.77,11.62 C1.1 26.65,11.7 U2.5 25.02,11.72 v25.02,14.83
  Top 0.5: 26.77,11.62 26.7,11.7 U2.5 25.05,13.15 C3.1 25.02,13.82 v25.02,14.83 | C1.1 C13.1 | C8.1 18.21,38.69 v18.21,37.16
  Bottom 0.254: v42.47,8.45 42.47,13.17 46.3,17 46.8,17 47.73,17.93 47.73,29.02 U$34.P$2 46.3,30.45 U$70.P$4 | v18.74,6.33 18.74,8.49 25.02,14.78 v25.02,14.83 | U$67.P$5 44.9,41.33 43.73,42.5 RN5.4 RN5.3 RN5.2 RN5.1
  Bottom 0.5: v25.02,14.83 18.51,21.34 18.51,25.46 16.26,27.71 16.26,31.82 v17.36,32.92 18.21,33.77 v18.21,37.16 19.96,37.16 24.73,41.92 v29.16,41.92
+5V  (via drill 0.38)
  Top 0.254: 22.4,9.75 U2.3 22.7,9.8 23.21,9.8 | RN4.1 20.36,2.23 22.25,4.11 U$91.P$2
  Top 0.4: 20.38,9.88 C15.1 | 22.65,9.75 22.7,9.8
  Top 0.5: U$91.P$2 22.25,7.45 C2.1 22.45,8.35 U2.3 | IC1.2 20.23,10.03 20.38,9.88 | C15.1 20.53,9.8 U2.3 | v21.64,8.91 21.64,9.8 U2.3 | U2.1 23.14,11.7 23.57,11.27 23.57,10.16 23.21,9.8 U2.3
  Bottom 0.4: 46.4,18.47 U$49.P$2
  Bottom 0.5: v21.64,8.91 21.65,8.93 36.85,8.93 46.4,18.47
  Bottom 1.3: U$50.P$2 U$48.P$2 U$49.P$2
+18V  (via drill 0.3, 0.38)
  Top 0.254: 3.5,19.6 U$30.P$2 | 1.14,27.75 1.14,25.75 2.14,26.75 | 1.14,27.75 1.14,38.14 2.95,39.95 | 3.4,26.75 2.14,26.75 | 2.14,26.75 1.14,27.75 | R28.2 7.43,5.02 v7.35,5.1 3.8,8.65 2.33,8.65 1.75,9.23 1.75,14.5 U$25.P$1 | RN4.3 19.98,3.9 v20.49,3.39 | U4.5 7.92,39.52 7.9,39.55
  Top 1: U$25.P$1 6.45,13.3 Q3.2 | U$30.P$2 3.46,19.75 1.52,21.7 1.52,25.45 | 1.52,25.45 2.82,26.75 | 2.82,26.75 3.4,26.75 U$27.P$2 | 2.82,26.75 1.52,28.05 | 1.52,28.05 1.52,33.8 | 1.52,28.05 1.52,26.55 1.52,25.45
  Top 1.5: U$30.P$2 1.52,21.73 1.52,26.55 | 1.52,26.55 1.52,33.8 1.52,38.52 2.95,39.95 7.5,39.95 7.9,39.55 C10.1 | U$27.P$2 1.72,26.75 1.52,26.55
  Top 1.65: U$25.P$1 U$30.P$2
  Bottom 0.254: v20.49,3.39 20.49,2.2 19.43,1.14 9.09,1.14 7.32,2.92 7.32,5.07 v7.35,5.1
CAP
  Top 0.254: U1.9 24.25,38.92 C4.2
CH340-DTR
  Top 0.254: Q1.1 37.03,17.58 | U6.13 34.87,15.41 37.03,17.58 | RN3.5 37.44,21.86 37.02,21.44 37.02,17.6 37.03,17.58
CH340-RTS
  Top 0.254: RN3.6 38.26,22.02 38.26,21.62 37.57,20.94 37.57,18.9 38.2,18.27 39.07,18.27 39.4,17.93 Q1.3 39.4,15.3 39.37,15.27 39.37,13.87 39,13.5 34.3,13.5 33.59,14.21 U6.14
CH340-RX  (via drill 0.3, 0.38)
  Top 0.254: U6.3 v33.6,10.1 | U5.35 v35.3,30.39 | v31.43,30.38 31.43,23.99 27.81,20.36 v27.81,20.25
  Bottom 0.254: v35.3,30.39 31.45,30.39 v31.43,30.38 | v27.81,20.25 27.81,15.89 v33.6,10.1
CH340-TX  (via drill 0.3, 0.38)
  Top 0.254: U6.2 32.33,10.07 v32.3,10.1 | v26.12,20.27 30.39,24.54 v30.39,30.38 | v35.31,29.11 U5.34
  Bottom 0.254: v32.3,10.1 26.12,16.27 v26.12,20.27 | v35.31,29.11 31.65,29.11 v30.39,30.38
CS  (via drill 0.38)
  Top 0.254: U5.29 34.57,22.77 v38.7,26.9 40.32,28.52 40.32,32.77 42.91,35.35 U$67.P$4 42.94,38.86
  Bottom 0.254: U$70.P$1 41.6,26.9 v38.7,26.9 | RN5.5 43.17,39.17 U$67.P$4
D+
  Top 0.254: U6.5 36.25,8.84 X3.B6 36.25,6.14 36.07,5.96 35.42,5.96 35.25,6.13 X3.A6
D-
  Top 0.254: U6.6 37.41,9.24 36.7,9.96 35.75,9.96 35.49,9.7 35.49,7.82 | 35.49,7.82 35.49,7.77 34.95,7.77 34.75,7.57 X3.B7 | 35.49,7.82 35.75,7.57 X3.A7
DPS_INT
  Top 0.254: RN2.6 31.4,39.98 30.11,41.27 U3.5
GND  (via drill 0.38)
  Top 0.254: U3.1 31.32,43.23 30.68,42.58 U3.7 | C9.2 19.94,44.96 v21,43.9 21.9,43 U1.2 | C8.2 19.94,38.75 U1.5 22.69,40.75 U1.6 | C4.1 30.65,38.75 RN2.3
  Bottom 0.254: U$70.P$3 v43.95,29.35
  other vias: 18.85,17.85 28.9,6.4 14.6,5.4 37,4.7 31.3,22.45 25.95,7.95 25.25,10.8 42.3,24.3 38.5,12.6 37.2,15.8 33.6,35.35 17.4,29.7 5.7,38 25,30.35 3.5,25 25,47.55 13.65,32.55 37.9,37.7 43.75,49 39.85,37.7 41.85,37.7 43.9,37.7 36.1,37.7 30.05,14.85 17.5,43.05 15.7,46.65 20.85,39.55
  pour Top: -1.7,51.9 -1.7,-1.45 51.8,-1.45 51.8,51.9
  pour Bottom: -2.35,52.5 -2.35,-1.98 52.45,-1.98 52.45,52.5
LED  (via drill 0.38)
  Top 0.254: U5.16 20.55,17.2 26.2,22.85 28.09,22.85 29.05,23.8 v29.05,26.15 | v46.05,28.5 44,30.55 U$59.P$1
  Bottom 0.254: v29.05,26.15 44.65,26.15 45.1,26.6 45.1,28.05 45.55,28.5 v46.05,28.5
MISO  (via drill 0.38)
  Top 0.254: U5.31 34.5,25.31 36.2,27.01 36.2,32.8 v38.9,35.5 U$67.P$2
  Bottom 0.254: v38.9,35.5 40.65,33.75 U$70.P$7 | RN5.6 42.3,40.4 41.75,39.85 39.85,39.85 U$67.P$2
MOSFET1  (via drill 0.38)
  Top 0.254: U5.10 15.98,22.79 v14.69,22.79 14.73,22.82 14.73,25.55 12.97,27.3 GENERALDIODE.P$3 | RN6.1 9.28,10.05 9.99,10.77 v9.99,11.12
  Bottom 0.254: v9.99,11.12 12.09,13.22 12.09,16.03 14.69,18.63 v14.69,22.79 14.69,26.96 U$100.P$1
MOSFET2  (via drill 0.38)
  Top 0.254: U5.11 15.68,21.18 14.14,21.18 v13.73,20.77 12.97,20.77 GENERALDIODE2.P$3 | RN6.2 8.4,10.52 v8.99,11.11
  Bottom 0.254: v8.99,11.11 11.19,13.3 11.19,16.57 13.73,19.12 v13.73,20.77 13.73,25.4 9.25,29.89 U$104.P$1
MOSI  (via drill 0.38)
  Top 0.254: U5.37 34.03,32.9 34.3,32.9 v36.9,35.5 U$67.P$1
  Bottom 0.254: v36.9,35.5 37.35,35.05 37.35,30.11 39.18,28.27 41.83,28.27 U$70.P$2 | RN5.7 41.5,40.6 41.2,40.3 38.3,40.3 U$67.P$1
MOT1  (via drill 0.38)
  Top 0.254: U5.8 15.62,25.31 14.77,26.16 14.77,34.08 v14.42,34.42 13.98,34.87 U4.2
  Bottom 0.254: 14.02,34.42 v14.42,34.42 13.77,34.42 U$105.P$1
MOT2  (via drill 0.38)
  Top 0.254: U5.9 17.11,24.04 18.11,25.05 18.11,34.23 16.21,36.13 v14.5,36.13 U4.3
  Bottom 0.254: v14.5,36.13 14.3,36.13 11.77,33.6 10.45,33.6 U$106.P$1
N$1
  Top 0.254: RN2.7 30.6,40.06 30.21,40.45 29.59,40.45 28.05,42 U1.17
N$3
  Top 0.254: D2.A 39.99,25.74 RN3.1
N$4  (via drill 3 pad 5.5)
  other vias: 3.6,46.4
N$5  (via drill 3 pad 5.5)
  other vias: 46.4,3.6
N$6  (via drill 0.38)
  Top 0.254: D1.A 41.92,3.24 v41.15,4.01 | RN4.5 v18,5.65 v17.99,5.66
  Bottom 0.254: v17.99,5.66 18.9,4.75 23.25,4.75 24,3.99 41.13,3.99 v41.15,4.01
N$9
  Top 0.254: R22.2 13.38,39.14 13.38,37.41 U4.4
N$10
  Top 0.254: RN4.6 17.46,3.9 14.72,6.64 6.71,6.64 4.25,9.1 D3.A
N$11
  Top 0.254: RN4.7 16.13,3.1 D4.A
N$12
  Top 0.254: RN4.8 17.53,1.75 15.1,1.75 D5.A
N$13  (via drill 3 pad 5.5)
  other vias: 46.4,46.4
N$14  (via drill 0.38)
  Top 0.254: Q1.5 38.75,19.78 v39.36,20.39 | v36.33,21.16 36.35,21.18 36.35,22.5 RN3.4
  Bottom 0.254: v39.36,20.39 38.59,21.16 v36.34,21.16 v36.33,21.16
N$15  (via drill 0.38)
  Top 0.254: Q1.2 38.75,16.73 38.8,16.69 v38.73,16.69 | v35.64,17.91 35.65,17.92 35.65,22.99 37.08,24.41 38.01,24.41 38.31,24.11 RN3.3
  Bottom 0.254: v38.73,16.69 36.86,16.69 v35.64,17.91
N$20
  Top 0.254: RN7.4 31.51,4.78 31.99,4.3 33.22,4.3 34.25,5.33 X3.A5 | X3.A5
N$22  (via drill 0.38)
  Top 0.254: RN6.6 7.6,8.1 v8.3,7.4 | D6.A 12.75,26.39 11.59,25.23 9.39,25.23 v9.39,25.25
  Bottom 0.254: v8.3,7.4 8.3,16.71 9.38,17.8 9.38,25.23 v9.39,25.25
N$23  (via drill 0.38)
  Top 0.254: v7.11,7.42 6.72,7.8 RN6.5 | v7.51,17.86 7.54,17.88 11.52,17.88 12.75,19.11 D7.A
  Bottom 0.254: v7.11,7.42 7.11,7.44 7.57,7.9 7.57,17.8 v7.51,17.86
N$25  (via drill 3 pad 5.5)
  other vias: 3.6,3.6
N$39
  Top 0.254: RN7.3 31.34,3.9 31.8,3.43 33.65,3.43 35.67,5.46 36.57,5.46 37.25,6.13 X3.B5
NEOPIX
  Top 0.254: U5.24 32.22,16.2 32.96,15.46 32.96,13.19 35.09,11.05 44.86,11.05 U$51.P$4
NEOUT
  Top 0.254: U$51.P$2 46.73,7.35 47.55,7.35 48.45,8.25 48.45,9.25 46.4,11.3 46.4,16.2 47.65,17.45 47.65,25.2 49,26.55 U$58.P$1
OUT1
  Top 0.254: 7.62,36.13 6.55,36.13
  Top 1: U4.6 6.55,36.13 4.62,36.13
  Top 1.27: U4.6 4.62,36.13 U$28.P$2
OUT2
  Top 0.254: 7.62,33.59 3.65,33.59
  Top 1: 3.65,33.59 U$28.P$1
  Top 1.27: U4.8 3.65,33.59
PNPRAW
  Top 0.254: 18.15,14.01 17.7,14.46 17.71,14.46 C14.1
  Top 0.8: 17.75,12.31 IC1.3
  Top 1: Q3.3 13.71,14.25 15.65,12.31 17.75,12.31 C14.1
PULL
  Bottom 0.254: RN5.8 40.58,40.95 35.9,40.95 35.25,40.3 35.25,37.25 35.85,36.65 39.5,36.65 41.3,34.85 U$70.P$8
PYRO1  (via drill 0.38)
  Top 0.254: 8.4,29.93 8.3,30.03 3.72,30.03 | RN6.3 7.6,10.29 6.79,11.11 v6.74,11.11 | U$52.P$2 GENERALDIODE.P$1
  Top 1: 11.81,29.93 U$52.P$2 | U$52.P$2 8.4,29.93 | U$52.P$2 3.82,29.93 3.72,30.03 U$27.P$1
  Top 1.27: 3.83,29.93 3.72,30.03
  Top 1.35: GENERALDIODE.P$1 3.83,29.93 U$27.P$1
  Bottom 0.254: v6.74,11.11 6.74,27.01 U$27.P$1
PYRO2  (via drill 0.38)
  Top 0.254: RN6.4 5.72,11.02 v5.72,11.1
  Top 1.3: GENERALDIODE2.P$1 3.83,22.93 U$30.P$1
  Top 1.35: GENERALDIODE2.P$1 U$53.P$2 3.82,22.93 U$30.P$1
  Bottom 0.254: v5.72,11.1 5.77,11.15 5.77,21 3.52,23.25 U$30.P$1
QPWR  (via drill 0.35, 0.38)
  Top 0.254: U5.25 34.81,16.88 35.7,16.88 36.33,17.51 v36.33,20.2 | v38.33,20.46 38.1,20.23 Q1.6 38.1,19.11 38.45,18.76 39.36,18.76 44.71,13.41 44.71,12.56 U$73.P$1
  Bottom 0.254: v38.33,20.46 36.59,20.46 v36.33,20.2
RAWUSB  (via drill 0.38)
  Top 0.254: RN4.4 19.5,5.62 v19.54,5.66 | v25.25,6.11 U$47.P$2 | 33.08,6.87 X3.A4B9 v33.1,7.68 | X3.B4A9 37.89,6.86 v37.89,7.67
  Bottom 0.254: v19.54,5.66 20,6.11 v25.25,6.11 25.25,6.13 26.98,7.86 32.85,7.86 33.03,7.68 v33.1,7.68 33.3,7.88 37.67,7.88 v37.89,7.67
RESET  (via drill 0.35, 0.38)
  Top 0.25: RN2.4 32.27,37.48 31.6,36.8 31.6,32.3 30.93,31.62 v18.93,31.62
  Top 0.254: v17.34,31.68 17.33,31.7 16.04,31.7 U5.3 | U$74.P$1 43.12,15.7 Q1.4 42.51,22.52 v42.51,22.95
  Bottom 0.254: v42.51,22.95 41.08,24.38 22.49,24.38 18.93,27.94 v18.93,31.62 17.4,31.62 v17.34,31.68
RX
  Top 0.254: U5.27 33.64,20.23 32.18,21.69 32.18,36.6 33.99,38.41 33.99,42.27 35.24,43.52 37.52,43.52 U$31.P$3
SCK  (via drill 0.38)
  Top 0.254: U5.30 34.5,24.04 38.2,27.74 38.2,32.8 v38.27,32.88 40.9,35.5 U$67.P$3
  Bottom 0.254: U$70.P$5 39.6,31.55 v38.27,32.88
SCL  (via drill 0.35, 0.38)
  Top 0.254: RN1.4 31.41,45.55 28.86,43 U1.19 28.68,43 v28.76,42.91 | U3.4 32.65,41.27 v32.89,41.03 v32.89,41.02 | v20.87,40.65 20.42,40.65 19.8,41.27 U$17.P$4 | U$32.P$4 10.12,44.66 16.8,37.98 16.8,37.96 v16.9,37.86 | U5.36 v35.3,31.66 v35.31,31.65
  Bottom 0.254: v16.9,37.86 18.05,37.86 20.84,40.65 v20.87,40.65 20.92,40.65 23.18,42.91 v28.76,42.91 31,42.91 v32.89,41.03 v32.89,41.02 32.89,34.15 35.31,31.73 v35.31,31.65
SDA  (via drill 0.35, 0.38)
  Top 0.254: RN1.3 28.77,43.81 U1.20 28.02,43.81 v28.11,43.72 | U3.3 32.52,41.92 v33.12,42.53 | U$17.P$3 20.55,41.92 v20.86,41.62 | U$32.P$1 11.12,44.49 16.73,38.89 v16.93,38.89 | U5.33 v35.31,27.85 v35.32,27.86
  Bottom 0.254: v16.93,38.89 18.13,38.89 v20.86,41.62 22.96,43.72 v28.11,43.72 31.93,43.72 v33.12,42.53 34.34,41.31 34.34,34.24 36.41,32.17 36.41,28.95 v35.32,27.86
SENSE  (via drill 0.35, 0.38)
  Top 0.254: 8.9,2.18 R28.1 R1.2 11.54,2.02 12.2,2.02 12.81,2.62 v12.81,5.92 | U5.7 16.34,26.58 17.35,25.57 v17.35,25.39
  Bottom 0.254: v12.81,5.92 13.22,6.34 13.22,15.8 16.44,19.02 16.44,24.48 v17.35,25.39
SERVO1  (via drill 0.38)
  Top 0.254: v21.62,22.09 21.61,22.09 17.18,17.68 16.02,17.68 U5.14
  Bottom 0.254: v21.62,22.09 21.64,22.09 29.11,22.09 29.7,21.5 32.5,21.5 33.1,22.1 39.42,22.1 40.46,21.06 U$48.P$1
SERVO2  (via drill 0.38)
  Top 0.254: U5.23 29.45,18.75 v29.46,18.76
  Bottom 0.254: U$49.P$1 43.86,18.72 43.8,18.78 29.48,18.78 v29.46,18.76
SERVO3  (via drill 0.38)
  Top 0.254: U5.12 17.16,20.23 21.01,24.08 v21.01,27.25
  Bottom 0.254: v21.01,27.25 22.98,25.27 42.35,25.27 43.86,23.76 U$50.P$1
SWITCH  (via drill 0.38)
  Top 0.254: U5.6 v17.39,27.85 v17.4,27.86 | RN3.7 RN3.8 v40.86,22.95 40.86,25.14 42.48,26.75 U$34.P$1
  Bottom 0.254: v40.86,22.95 40.36,23.45 22,23.45 17.6,27.86 v17.4,27.86
TX
  Top 0.254: U5.28 33.67,21.5 33.59,21.58 33.6,21.58 32.77,22.41 32.77,36.4 34.63,38.25 34.63,41.96 35.59,42.91 38.91,42.91 U$31.P$4
VBUS  (via drill 0.3, 0.38)
  Top 0.254: Q3.1 10.85,15.2 11.3,15.65 v14,15.65 | U$91.P$1 22.25,2.96 v22.6,3.31
  Top 0.8: U$47.P$1 22.37,1.95 U$91.P$1
  Bottom 0.254: v22.6,3.31 21.73,4.19 18.49,4.19 14.9,7.78 14.9,14.75 v14,15.65
XIN
  Top 0.254: C6.1 22.86,46.25 X1.P$1 23.75,46.2 U1.27
XOUT
  Top 0.254: C7.1 27.08,46.25 X1.P$2 26.2,46.15 24.25,44.2 U1.26
(copper drawn outside any net)
  shapes: Bottom area x1, Top area x1

### Text on the board
bPlace: +